# Altium schematic sheet Top_Subway.SchDoc
size A; SheetNumber: 1; SheetTotal: 3
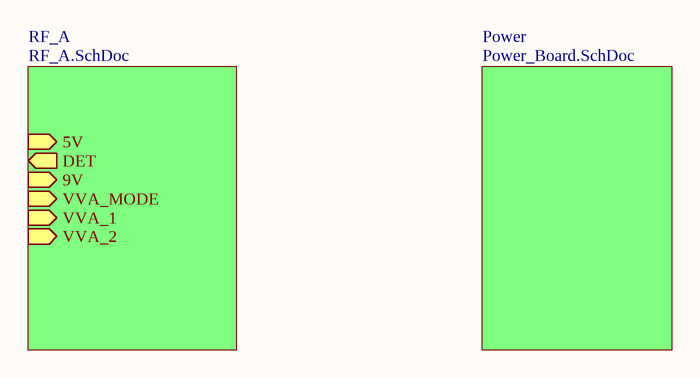
[diagram p0: Top_Subway.SchDoc]

## Sub-sheets
Power = Power_Board.SchDoc: no entries
RF_A = RF_A.SchDoc: 5V (in), DET (out), 9V (in), VVA_MODE (in), VVA_1 (in), VVA_2 (in)